# Altium schematic sheet schematic.SchDoc
size OrCAD D; SheetNumber: 1; SheetTotal: 1
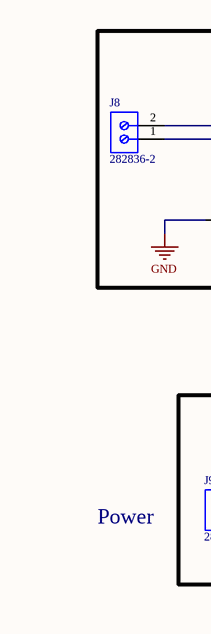
[diagram p0: schematic.SchDoc, left]
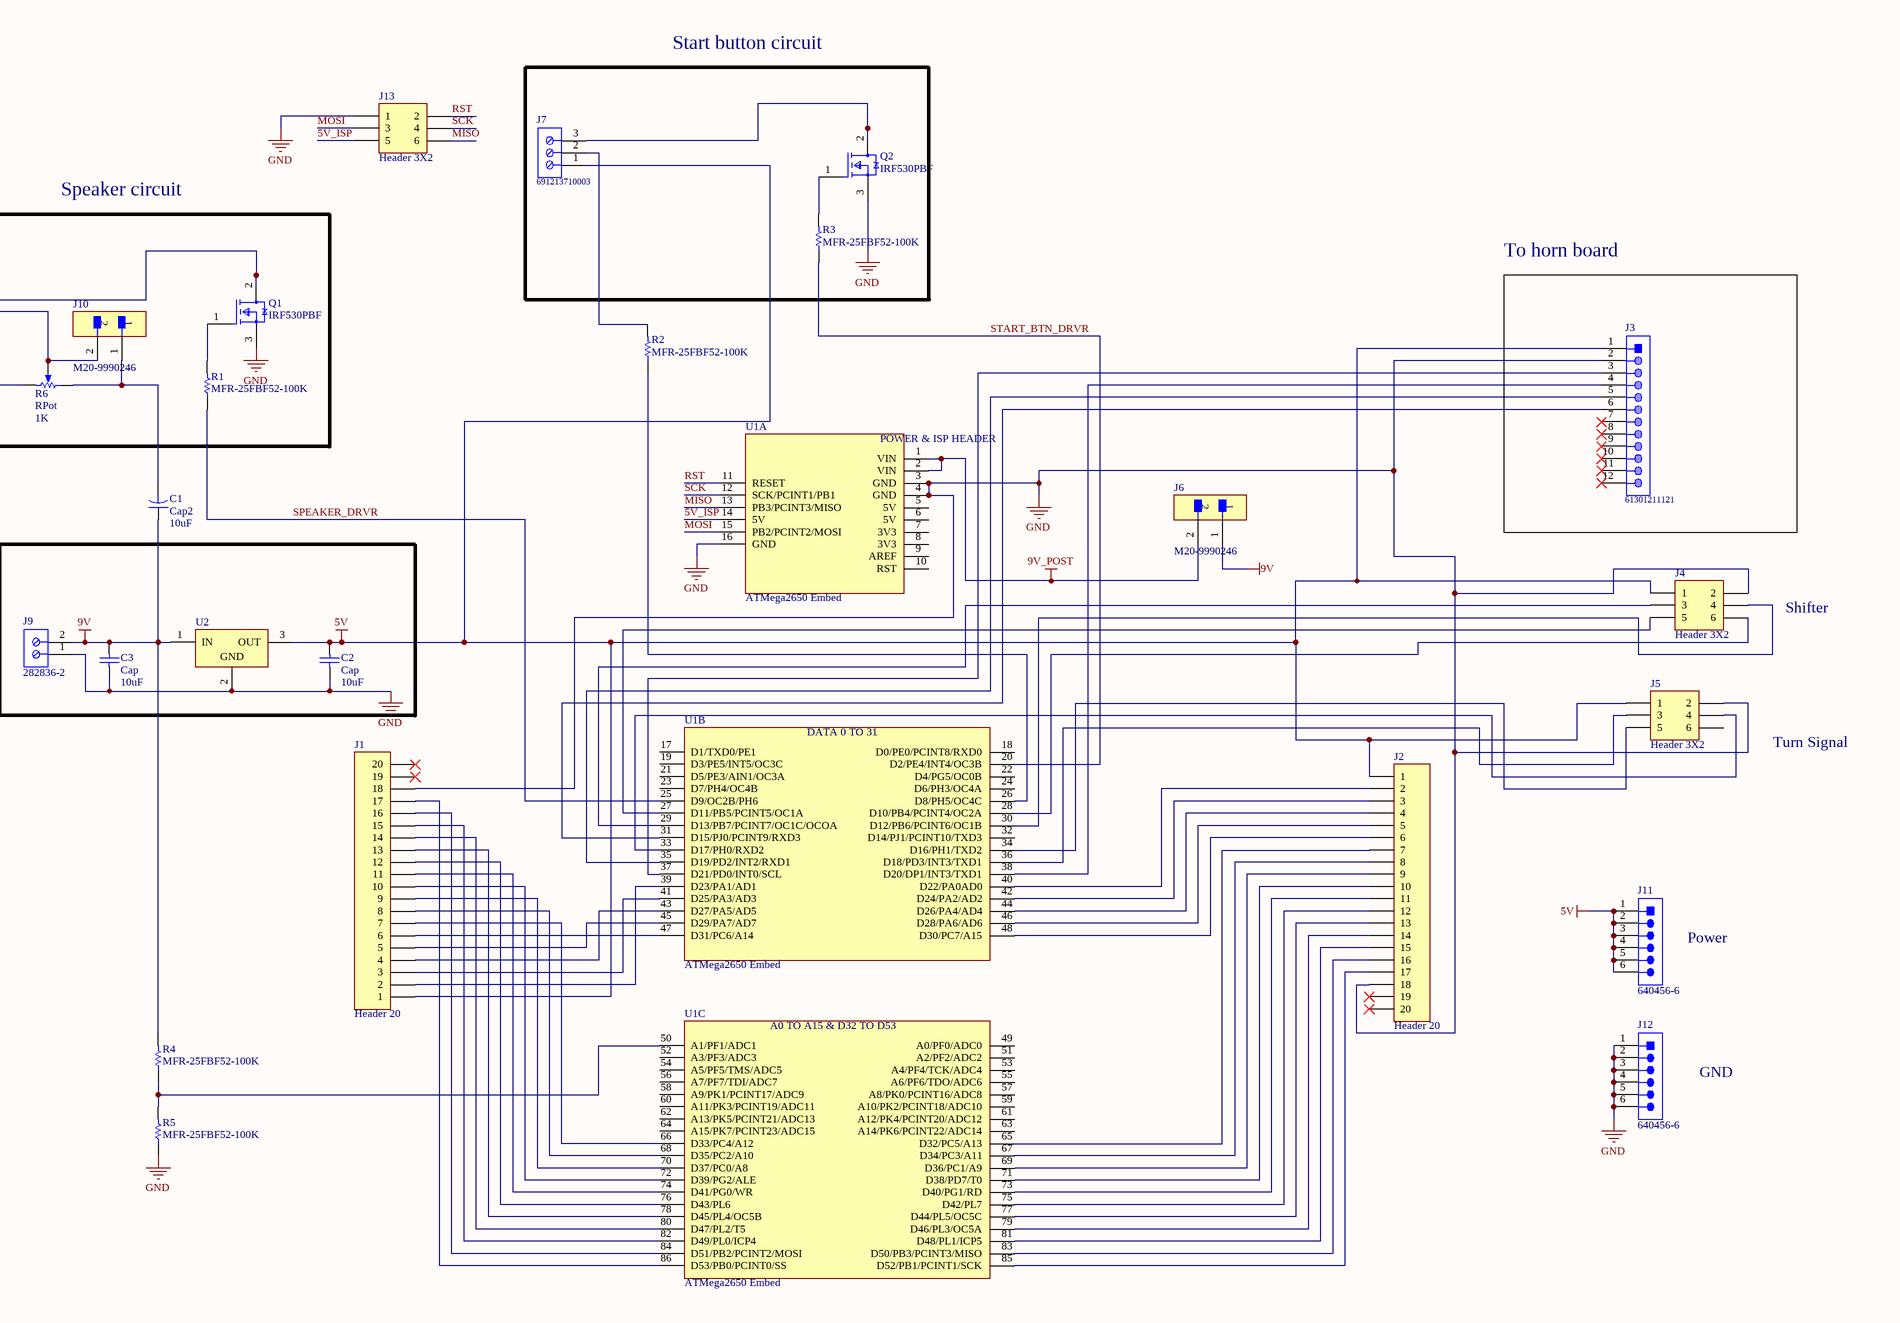
[diagram p1: schematic.SchDoc, right]

## Parts
C1  Cap2  value 10uF  [CAPR5-4X5]
C2  Cap  value 10uF  [RAD-0.3]
C3  Cap  value 10uF  [RAD-0.3]
J1  Header 20  [HDR1X20]
J2  Header 20  [HDR1X20]
J3  61301211121  [61301211121]
J4  Header 3X2  [HDR2X3]
J5  Header 3X2  [HDR2X3]
J6  M20-9990246  [FP-M20-9990246-MFG]
J7  691213710003  [691213710003]
J8  282836-2  [TECO-282836-2_V]
J9  282836-2  [TECO-282836-2_V]
J10  M20-9990246  [FP-M20-9990246-MFG]
J11  640456-6  [TECO-640456-6_V]
J12  640456-6  [TECO-640456-6_V]
J13  Header 3X2  [HDR2X3]
Q1  IRF530PBF  [FP-X15-0364-MFG]
Q2  IRF530PBF  [FP-X15-0364-MFG]
R1  MFR-25FBF52-100K  [RESA60-630X240]
R2  MFR-25FBF52-100K  [RESA60-630X240]
R3  MFR-25FBF52-100K  [RESA60-630X240]
R4  MFR-25FBF52-100K  [RESA60-630X240]
R5  MFR-25FBF52-100K  [RESA60-630X240]
R6  RPot  value 1K  [VR5]
U1  ATMega2650 Embed  [ATMEGA2650 Embed]  (parts A,B,C of 3)
U2  L7812CV  [TO220]  (value not drawn)

## Blocks framed on the sheet
Start button circuit: J7 Q2 R3
Speaker circuit: J8 J10 Q1 R1 R6
To horn board: J3

## Nets
5V: C2.2 J1.1 J2.1 J3.1 J4.1 J5.1 J7.1 J11.1 J11.2 J11.3 J11.4 J11.5 J11.6 U2.3(OUT)
9V: C1.1 C3.2 J6.1 J9.2 R4.2 U2.1(IN)
9V_POST: J6.2 U1.1(VIN) U1.2(VIN)
GND: C2.1 C3.1 J1.18 J2.18 J3.2 J4.2 J5.2 J9.1 J12.1 J12.2 J12.3 J12.4 J12.5 J12.6 J13.1 Q1.3(S) Q2.3(S) R5.1 R6.2(BOT) U1.3(GND) U1.4(GND) U1.16(GND) U2.2(GND)
5V_ISP: J13.5 U1.14(5V)
MISO: J13.6 U1.13(PB3/PCINT3/MISO)
MOSI: J13.3 U1.15(PB2/PCINT2/MOSI)
RST: J13.2 U1.11(RESET)
SCK: J13.4 U1.12(SCK/PCINT1/PB1)
SPEAKER_DRVR: R1.1 U1.25(D9/OC2B/PH6)
START_BTN_DRVR: R3.1 U1.20(D2/PE4/INT4/OC3B)
NetC1_2: C1.2 J10.1 R6.1(TOP)
NetJ1_2: J1.2 U1.39(D23/PA1/AD1)
NetJ1_3: J1.3 U1.41(D25/PA3/AD3)
NetJ1_4: J1.4 U1.43(D27/PA5/AD5)
NetJ1_5: J1.5 U1.45(D29/PA7/AD7)
NetJ1_6: J1.6 U1.47(D31/PC6/A14)
NetJ1_7: J1.7 U1.66(D33/PC4/A12)
NetJ1_8: J1.8 U1.68(D35/PC2/A10)
NetJ1_9: J1.9 U1.70(D37/PC0/A8)
NetJ1_10: J1.10 U1.72(D39/PG2/ALE)
NetJ1_11: J1.11 U1.74(D41/PG0/WR)
NetJ1_12: J1.12 U1.76(D43/PL6)
NetJ1_13: J1.13 U1.78(D45/PL4/OC5B)
NetJ1_14: J1.14 U1.80(D47/PL2/T5)
NetJ1_15: J1.15 U1.82(D49/PL0/ICP4)
NetJ1_16: J1.16 U1.84(D51/PB2/PCINT2/MOSI)
NetJ1_17: J1.17 U1.86(D53/PB0/PCINT0/SS)
NetJ2_2: J2.2 U1.40(D22/PA0AD0)
NetJ2_3: J2.3 U1.42(D24/PA2/AD2)
NetJ2_4: J2.4 U1.44(D26/PA4/AD4)
NetJ2_5: J2.5 U1.46(D28/PA6/AD6)
NetJ2_6: J2.6 U1.48(D30/PC7/A15)
NetJ2_7: J2.7 U1.65(D32/PC5/A13)
NetJ2_8: J2.8 U1.67(D34/PC3/A11)
NetJ2_9: J2.9 U1.69(D36/PC1/A9)
NetJ2_10: J2.10 U1.71(D38/PD7/T0)
NetJ2_11: J2.11 U1.73(D40/PG1/RD)
NetJ2_12: J2.12 U1.75(D42/PL7)
NetJ2_13: J2.13 U1.77(D44/PL5/OC5C)
NetJ2_14: J2.14 U1.79(D46/PL3/OC5A)
NetJ2_15: J2.15 U1.81(D48/PL1/ICP5)
NetJ2_16: J2.16 U1.83(D50/PB3/PCINT3/MISO)
NetJ2_17: J2.17 U1.85(D52/PB1/PCINT1/SCK)
NetJ3_3: J3.3 U1.37(D21/PD0/INT0/SCL)
NetJ3_4: J3.4 U1.38(D20/DP1/INT3/TXD1)
NetJ3_5: J3.5 U1.35(D19/PD2/INT2/RXD1)
NetJ3_6: J3.6 U1.31(D15/PJ0/PCINT9/RXD3)
NetJ4_3: J4.3 U1.29(D13/PB7/PCINT7/OC1C/OCOA)
NetJ4_4: J4.4 U1.30(D12/PB6/PCINT6/OC1B)
NetJ4_5: J4.5 U1.27(D11/PB5/PCINT5/OC1A)
NetJ4_6: J4.6 U1.28(D10/PB4/PCINT4/OC2A)
NetJ5_3: J5.3 U1.36(D18/PD3/INT3/TXD1)
NetJ5_4: J5.4 U1.33(D17/PH0/RXD2)
NetJ5_5: J5.5 U1.34(D16/PH1/TXD2)
NetJ7_2: J7.2 R2.2
NetJ7_3: J7.3 Q2.2(D)
NetJ8_1: J8.1 J10.2 R6.3(TAP)
NetJ8_2: J8.2 Q1.2(D)
NetQ1_1: Q1.1(G) R1.2
NetQ2_1: Q2.1(G) R3.2
NetR2_1: R2.1 U1.26(D8/PH5/OC4C)
NetR4_1: R4.1 R5.2 U1.50(A1/PF1/ADC1)

Not connected (* = marked no-connect by the designer): J1 19* 20*; J2 19* 20*; J3 7* 8* 9* 10* 11* 12*; J5 6; U1 5(5V) 6(5V) 7(3V3) 8(3V3) 9(AREF) 10(RST) 17(D1/TXD0/PE1) 18(D0/PE0/PCINT8/RXD0) 19(D3/PE5/INT5/OC3C) 21(D5/PE3/AIN1/OC3A) 22(D4/PG5/OC0B) 23(D7/PH4/OC4B) 24(D6/PH3/OC4A) 32(D14/PJ1/PCINT10/TXD3) 49(A0/PF0/ADC0) 51(A2/PF2/ADC2) 52(A3/PF3/ADC3) 53(A4/PF4/TCK/ADC4) 54(A5/PF5/TMS/ADC5) 55(A6/PF6/TDO/ADC6) 56(A7/PF7/TDI/ADC7) 57(A8/PK0/PCINT16/ADC8) 58(A9/PK1/PCINT17/ADC9) 59(A10/PK2/PCINT18/ADC10) 60(A11/PK3/PCINT19/ADC11) 61(A12/PK4/PCINT20/ADC12) 62(A13/PK5/PCINT21/ADC13) 63(A14/PK6/PCINT22/ADC14) 64(A15/PK7/PCINT23/ADC15)

## Notes on the sheet
- Power
- Shifter
- Turn Signal
- GND
- (in symbol ATMega2650 Embed, part A) POWER & ISP HEADER
- (in symbol ATMega2650 Embed, part B) DATA 0 TO 31
- (in symbol ATMega2650 Embed, part C) A0 TO A15 & D32 TO D53

## Library data of the parts
C1 = Cap2: Capacitor; Published: 23-Sep-2002; PackageReference: CAPR5-4X5; Publisher: Altium Limited; PackageDescription: Capacitor; 2 Leads
C2 C3 = Cap: Capacitor; Published: 8-Jun-2000; LatestRevisionDate: 17-Jul-2002; LatestRevisionNote: Re-released for DXP Platform.; PackageReference: RAD-0.3; Publisher: Altium Limited; PackageDescription: Radial Cap, Thru-Hole; 2 Leads; 0.3 in Pin Spacing
J1 J2 = Header 20: Header, 20-Pin; LatestRevisionDate: 17-Jul-2002; LatestRevisionNote: Re-released for DXP Platform.; Publisher: Altium Limited
J3 = CMP-1502-01086-1: THT Vertical Pin Header WR-PHD, Pitch 2.54 mm, Single Row, 12 pins; Manufacturer: Wurth Elektronik; Pin Number: 12; Gender: Male; Working Voltage: 250VAC; Rated Current: 3A; Withstanding Voltage: 500VAC; Pitch: 2.54mm; Contact Resistance: 20mOhm; Orientation: Vertical; Package Reference: 61301211121; Packaging: Bag; Operating Temperature: -40to105degC; Mounting Technology: THT; Part Number: 61301211121; Manufacturer URL: http://www.we-online.de; Row Number: Single; Publisher: WurthElektronik; Datasheet URL: https://katalog.we-online.de/em/datasheet/6130xx11121.pdf
J4 J5 J13 = Header 3X2: Header, 3-Pin, Dual row; LatestRevisionDate: 17-Jul-2002; LatestRevisionNote: Re-released for DXP Platform.; Publisher: Altium Limited
J6 J10 = CMP-15831-000009-1: CONN HEADER VERT 2POS 2.54MM; Manufacturer: Harwin; Conn Gender: Male; Conn Orientation: Vertical; Number Of Contacts: 2; Current Rating: 3A; ComponentLink2URL: https://cdn.harwin.com/pdfs/M20-999.pdf; ComponentLink2Description: Datasheet; Package: M20-9990246; Temperature: -40°C to +105°C; Octopart: https://octopart.com/m20-9990246-harwin-2590635; Mouser Description: 2.54mm (0.1") Pitch SIL Vertical PC Tail Pin Header, 6.1mm mating pin height, tin, 2 contacts; Temperature Range High: +105°C; Device Class L1: Connectors; RoHS: TRUE; Automotive: No; Height: 8.99mm; Number Of Rows: 1; Contact Material: Tin,Nickel; Category: Conn; Pitch: 2.54mm; Lead Free: Yes; Digikey Description: CONN HEADER VERT 2POS 2.54MM; Manufacturer Part Number: M20-9990246; Temperature Range Low: -40°C; Device Class L3: unset; Device Class L2: Headers and Wire Housings
J7 = CMP-1502-02527-1: Serie 213 - 5.00 mm Horizontal Entry Modular with RisingCage Clamp WR-TBL, 3 pin; Manufacturer: Wurth Elektronik; Pin Number: 3; Pitch: 5.00mm; Manufacturer URL: http://www.we-online.de; Mounting Technology: THT; Packaging: Box; Datasheet URL: http://katalog.we-online.de/em/datasheet/6912137100xx.pdf; Operating Temperature: -40to105degC; Part Number: 691213710003; Package Reference: 691213710003; Publisher: WurthElektronik
J8 J9 = CMP-1684-00017-1: Female Header, Pitch 5 mm, 1 x 2 Position, Height 10 mm, Tail Length 3.5 mm, Rohs, Bulk; Manufacturer: TE Connectivity; Wire Gauge: 16-30AWG; Product Training Modules: Wire-to-BoardEurostyleTerminalBlocks; Clamp Material - Plating: Brass-NickelPlated; Voltage: 300V; Mating Orientation: HorizontalwithBoard; Current: 13.5A; Pitch: 0.197"(5.00mm); Screw Thread: M3; 3D Model: 282836-2.pdf; Other Names: 5ULV-02B / A98076; Dynamic Catalog: BuchananSeries; Number of Levels: 1; Torque - Screw: 0.68Nm(6Lb-In); Featured Product: EurostyleTerminalBlockConnectors; Positions Per Level: 2; Wire Termination: Screw-RisingCageClamp; Datasheet URL: http://www.te.com.cn/commerce/DocumentDelivery/DDEController?Action=showdoc&DocId=Catalog+Section%7F1308389_EUROSTYLE_TERMINAL_BLOCKS%7F0607%7Fpdf%7FEnglish%7FENG_CS_1308389_EUROSTYLE_TERMINAL_BLOCKS_0607.pdf%7F282836-2; Color: Green; Family: TerminalBlocks-WiretoBoard; RoHS Information: 282836-2StatementofCompliance; Standard Package: 300; Contact Material - Plating: Brass-TinPlated; Manufacturer URL: http://www.te.com; Housing Material: Polyamide(PA66),Nylon6/6; Features: Interlocking(Side); Package Description: Female Header, Pitch 5 mm, 1 x 2 Position, Height 10 mm, Tail Length 3.5 mm; Mounting Type: ThroughHole; Package Reference: THD; Packaging: Bulk; Series: Buchanan; Category: Connectors,Interconnects; Screw Material - Plating: Brass-NickelPlated
J11 J12 = CMP-2000-05661-1: Male Header, Pitch 2.54 mm, 1 x 6 Position, Height 10.03 mm, Tail Length 3.56 mm, -55 to 105 degC, Bulk; Manufacturer: TE Connectivity; Contact Centerline Spacing: 0.100 / in.; Number of Contacts: 6; Current, Rating: 5 / A; Agency Approvals: CSA,UL; Material, Contact: CopperAlloy; Mounting Hole Size: 0.04 / "; Brand/Series: MTA-100Series; Pin Spacing: 0.1 / "; Mount Angle: Vertical; Contact Termination Area Plating: Tin; Angle: Straight; Primary Type: InterconnectSystem; Standards: RoHSCompliant,ELVCompliant,UL94V-0; Temperature, Operating: -55to+105 / °C; Material, Housing: Polyester; Special Features: Pinstrip; Color, Housing: White; Connector Type: MTA-100; Voltage, Rating: 250 / V; Termination: Solder; Package Reference: 640456-6; Size, Post: 0.025 / in.; Color: White; Datasheet URL: https://datasheet.ciiva.com/25618/0900766b80eb7fdd-25618163.pdf; Manufacturer URL: http://www.te.com/; Mounting Type: PCMount; Length, Pin: 0.14 / "; Type: PCBPlug; Length, Overall: 0.6 / "; Mounting Technology: ThroughHole; Number of Rows: 1; Contact Shape: Square; Contact Mating Area Plating: Tin; Datasheet Version: Rev. W, 05/2005; Number of Positions: 6; Package Description: Male Header, Pitch 2.54 mm, 1 x 6 Position, Height 10.03 mm, Tail Length 3.56 mm; Contact Plating: Tin; Length, Terminal Post: 0.14 / in.; Flammability Rating: UL94V-0
Q1 Q2 = CMP-02550-000190-1: MOSFET N-CH 100V 14A TO-220AB; Manufacturer: Vishay; Reverse Recovery Charge: 850nC; Rthja Max: 62°C/W; Power Dissipation: 88W; Depletion Mode: False; Input Capacitace At Vds: 670pF @ 25V; Pulse Drain Current: 56A; Turn On Delay Time: 10ns; Drain To Source Resistance: 0.16Ω; Number Of N Channels: 1; Max Junction Temp: +175°C; Threshold Vgs Max: 4V; Standoff Height: 3.33mm; Max Forward Diode Voltage: 2.5V; Turn Off Delay Time: 23ns; Gate To Source Voltage: 20V; Threshold Vgs Min: 2V; Reverse Recovery Time: 150ns; Gate Charge At Vgs: 26nC @ 10V; Temperature: -55°C to +175°C; Drain To Source Voltage: 100V; Mouser Description: MOSFET N-Chan 100V 14 Amp; Device Class L2: Transistors; Temperature Range High: +175°C; ComponentLink2URL: http://www.vishay.com/docs/91019/91019.pdf; Lead Free: Yes; Height: 19.89mm; Octopart: https://octopart.com/irf530pbf-vishay-46547999; Category: Trans; ComponentLink2Description: Datasheet; RoHS: TRUE; Device Class L3: MOSFETs; Automotive: No; Device Class L1: Discrete Semiconductors; Package: X15-0364; Manufacturer Part Number: IRF530PBF; Continuous Drain Current: 14A; Digikey Description: MOSFET N-CH 100V 14A TO-220AB; Number Of Channels: 1; Drain To Source Breakdown Voltage: 100V; Temperature Range Low: -55°C
R1-R5 = CMP-1659-00073-1: Axial Resistor, 100 KOhm, +/- 1%, 0.25 W, -55 to 155 degC, 2-Pin THD, RoHS, Bulk; Voltage Rating: 250 V; Power Rating: 250 mW; Resistance: 475 Ohm; PackageDescription: 2-Pin Axial Lead, Dia 2.4 mm, Body Length 6.3 mm; PackageReference: MFR-25; Length: 0.248 inch; ComponentLink2Description: Datasheet; Packaging: Bulk; DatasheetVersion: Apr-13; Package Quantity: 200; Min Operating Temperature: -55 degC; ComponentLink2URL: http://www.yageo.com/documents/recent/Yageo%20LR_MFR_2013.pdf; RoHSCompliant: true; ComponentLink1URL: http://www.yageo.com/; Tolerance: 1%; Case\Package: Axial; Mount: Through Hole; ComponentLink1Description: Manufacturer URL; Max Operating Temperature: 155 degC
R6 = RPot: Potentiometer; Sim Note: Enter the Resistance value and the set point into parameter fields.; Set Position: 0.5; Published: 8-Jun-2000; LatestRevisionDate: 17-Jul-2002; LatestRevisionNote: Re-released for DXP Platform.; PackageReference: VR5; Publisher: Altium Limited; PackageDescription: Variable Resistor, Thru-Hole; 3 Leads
U2 = CMP-0244-00450-1: Positive Voltage Regulator, 12V, 3-Pin TO-220; PackageDescription: TO, Thru-Hole, Vertical, Heatsink Mounted; 3 In-Line Leads; Pitch 2.54 mm; ComponentLink3URL: http://www.st.com/internet/com/TECHNICAL_RESOURCES/TECHNICAL_LITERATURE/PACKAGE_INFORMATION/CD00004649.pdf; ComponentLink1URL: http://www.st.com; ComponentLink2Description: Datasheet; ComponentLink3Description: Package Specification; ComponentLink2URL: http://www.st.com/internet/com/TECHNICAL_RESOURCES/TECHNICAL_LITERATURE/DATASHEET/CD00000444.pdf; DatasheetVersion: 16/11/2011; PackageVersion: ver3.0; PackageReference: TO220; ComponentLink1Description: Manufacturer URL